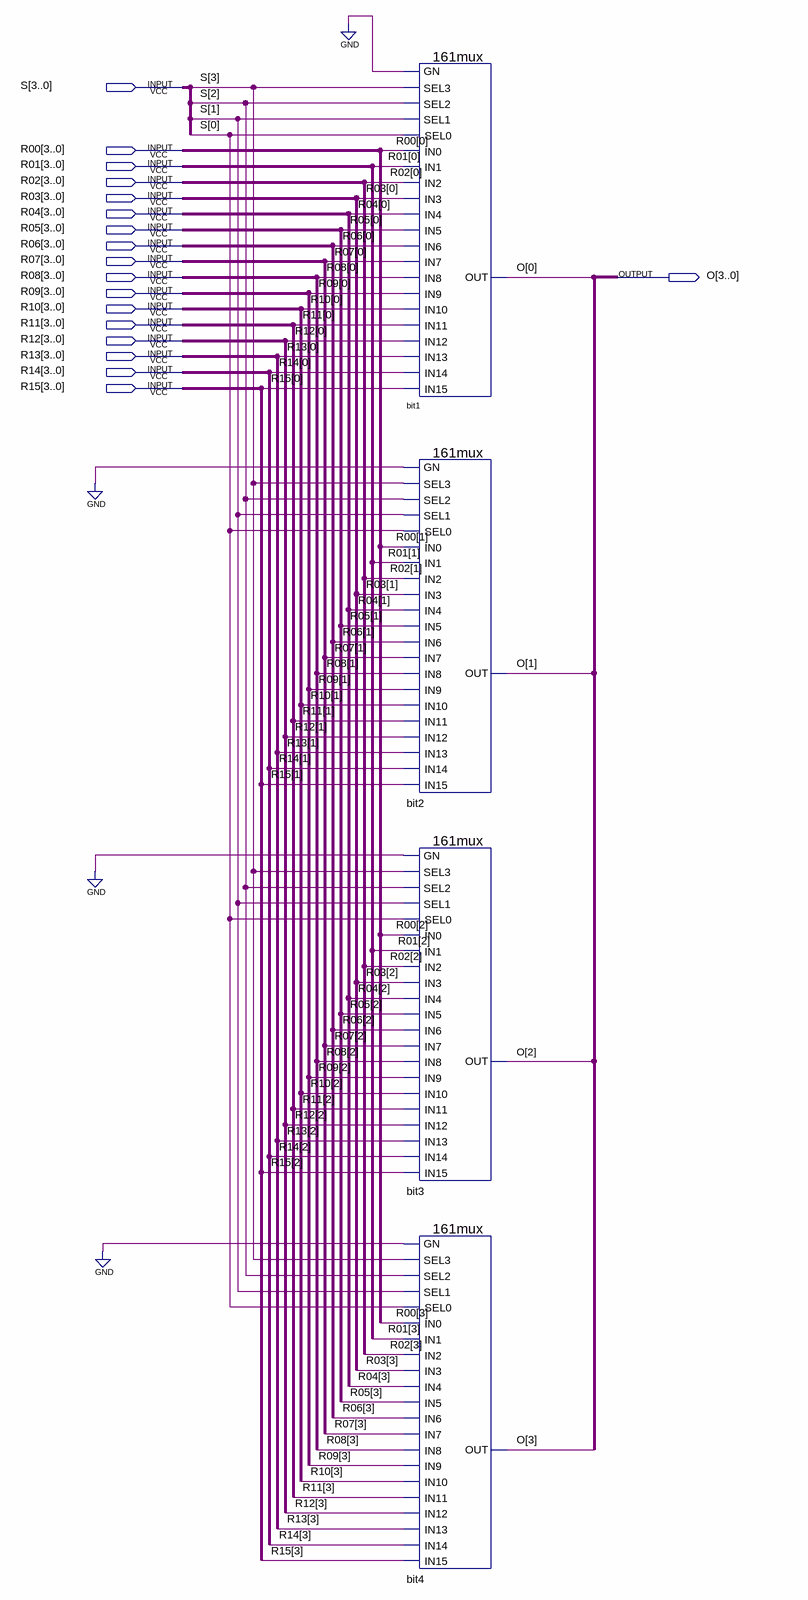
[diagram p0: schematic sheet]
// Quartus schematic 4bit16to1Mux.bdf as structural Verilog: 4 symbols, 18 pins
module \4bit16to1Mux  (
  input  [3:0] S,
  input  [3:0] R00,
  input  [3:0] R01,
  input  [3:0] R02,
  input  [3:0] R03,
  input  [3:0] R04,
  input  [3:0] R05,
  input  [3:0] R06,
  input  [3:0] R07,
  input  [3:0] R08,
  input  [3:0] R09,
  input  [3:0] R10,
  input  [3:0] R11,
  input  [3:0] R12,
  input  [3:0] R13,
  input  [3:0] R14,
  input  [3:0] R15,
  output [3:0] O
);

  \161mux  bit1 (
    .SEL3(S[3]), .GN(1'b0), .IN0(R00[0]), .SEL0(S[0]), .SEL1(S[1]), .SEL2(S[2]), .IN3(R03[0]), .IN2(R02[0]),
    .IN1(R01[0]), .IN6(R06[0]), .IN5(R05[0]), .IN4(R04[0]), .IN9(R09[0]), .IN8(R08[0]), .IN7(R07[0]),
    .IN11(R11[0]), .IN12(R12[0]), .IN10(R10[0]), .IN15(R15[0]), .IN14(R14[0]), .IN13(R13[0]), .OUT(O[0]));
  \161mux  bit2 (
    .SEL3(S[3]), .GN(1'b0), .IN0(R00[1]), .SEL0(S[0]), .SEL1(S[1]), .SEL2(S[2]), .IN3(R03[1]), .IN2(R02[1]),
    .IN1(R01[1]), .IN6(R06[1]), .IN5(R05[1]), .IN4(R04[1]), .IN9(R09[1]), .IN8(R08[1]), .IN7(R07[1]),
    .IN11(R11[1]), .IN12(R12[1]), .IN10(R10[1]), .IN15(R15[1]), .IN14(R14[1]), .IN13(R13[1]), .OUT(O[1]));
  \161mux  bit3 (
    .SEL3(S[3]), .GN(1'b0), .IN0(R00[2]), .SEL0(S[0]), .SEL1(S[1]), .SEL2(S[2]), .IN3(R03[2]), .IN2(R02[2]),
    .IN1(R01[2]), .IN6(R06[2]), .IN5(R05[2]), .IN4(R04[2]), .IN9(R09[2]), .IN8(R08[2]), .IN7(R07[2]),
    .IN11(R11[2]), .IN12(R12[2]), .IN10(R10[2]), .IN15(R15[2]), .IN14(R14[2]), .IN13(R13[2]), .OUT(O[2]));
  \161mux  bit4 (
    .SEL3(S[3]), .GN(1'b0), .IN0(R00[3]), .SEL0(S[0]), .SEL1(S[1]), .SEL2(S[2]), .IN3(R03[3]), .IN2(R02[3]),
    .IN1(R01[3]), .IN6(R06[3]), .IN5(R05[3]), .IN4(R04[3]), .IN9(R09[3]), .IN8(R08[3]), .IN7(R07[3]),
    .IN11(R11[3]), .IN12(R12[3]), .IN10(R10[3]), .IN15(R15[3]), .IN14(R14[3]), .IN13(R13[3]), .OUT(O[3]));
endmodule
